# EAGLE schematic M5StickCplusbattery (EAGLE 9.6.2)
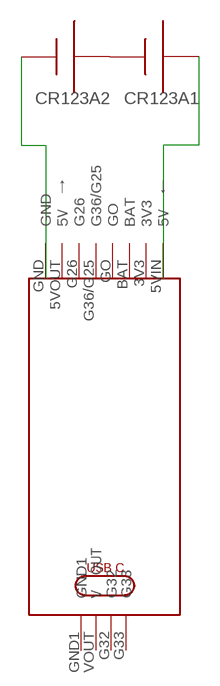
[diagram p0: schematic, sheet 1]

## Parts
CR123A1  AAA  [12BH412]
CR123A2  AAA  [12BH412]
U$1  M5STICKCPLUS  [M5STICK]

## Nets
N$1: CR123A1.+ CR123A2.-
N$2: CR123A2.+ U$1.GND
N$3: CR123A1.- U$1.5VIN(5V　←)
Unconnected: U$1.3V3 U$1.5VOUT(5V　→) U$1.BAT U$1.G26 U$1.G32 U$1.G33 U$1.G36/G25 U$1.GND1 U$1.GO U$1.VOUT(V　OUT)

## Library data of the parts
CR123A1 CR123A2 = adafruit:AAA: AAA PC pin holder Mouser part #12BH412 - but pretty much any 1x AAA battery holder should be the same http://www.ladyada.net/library/pcb/eaglelibrary.html
U$1 = M5stickcPlus:M5STICKCPLUS